# Altium schematic sheet PAGE1.SchDoc
size A3
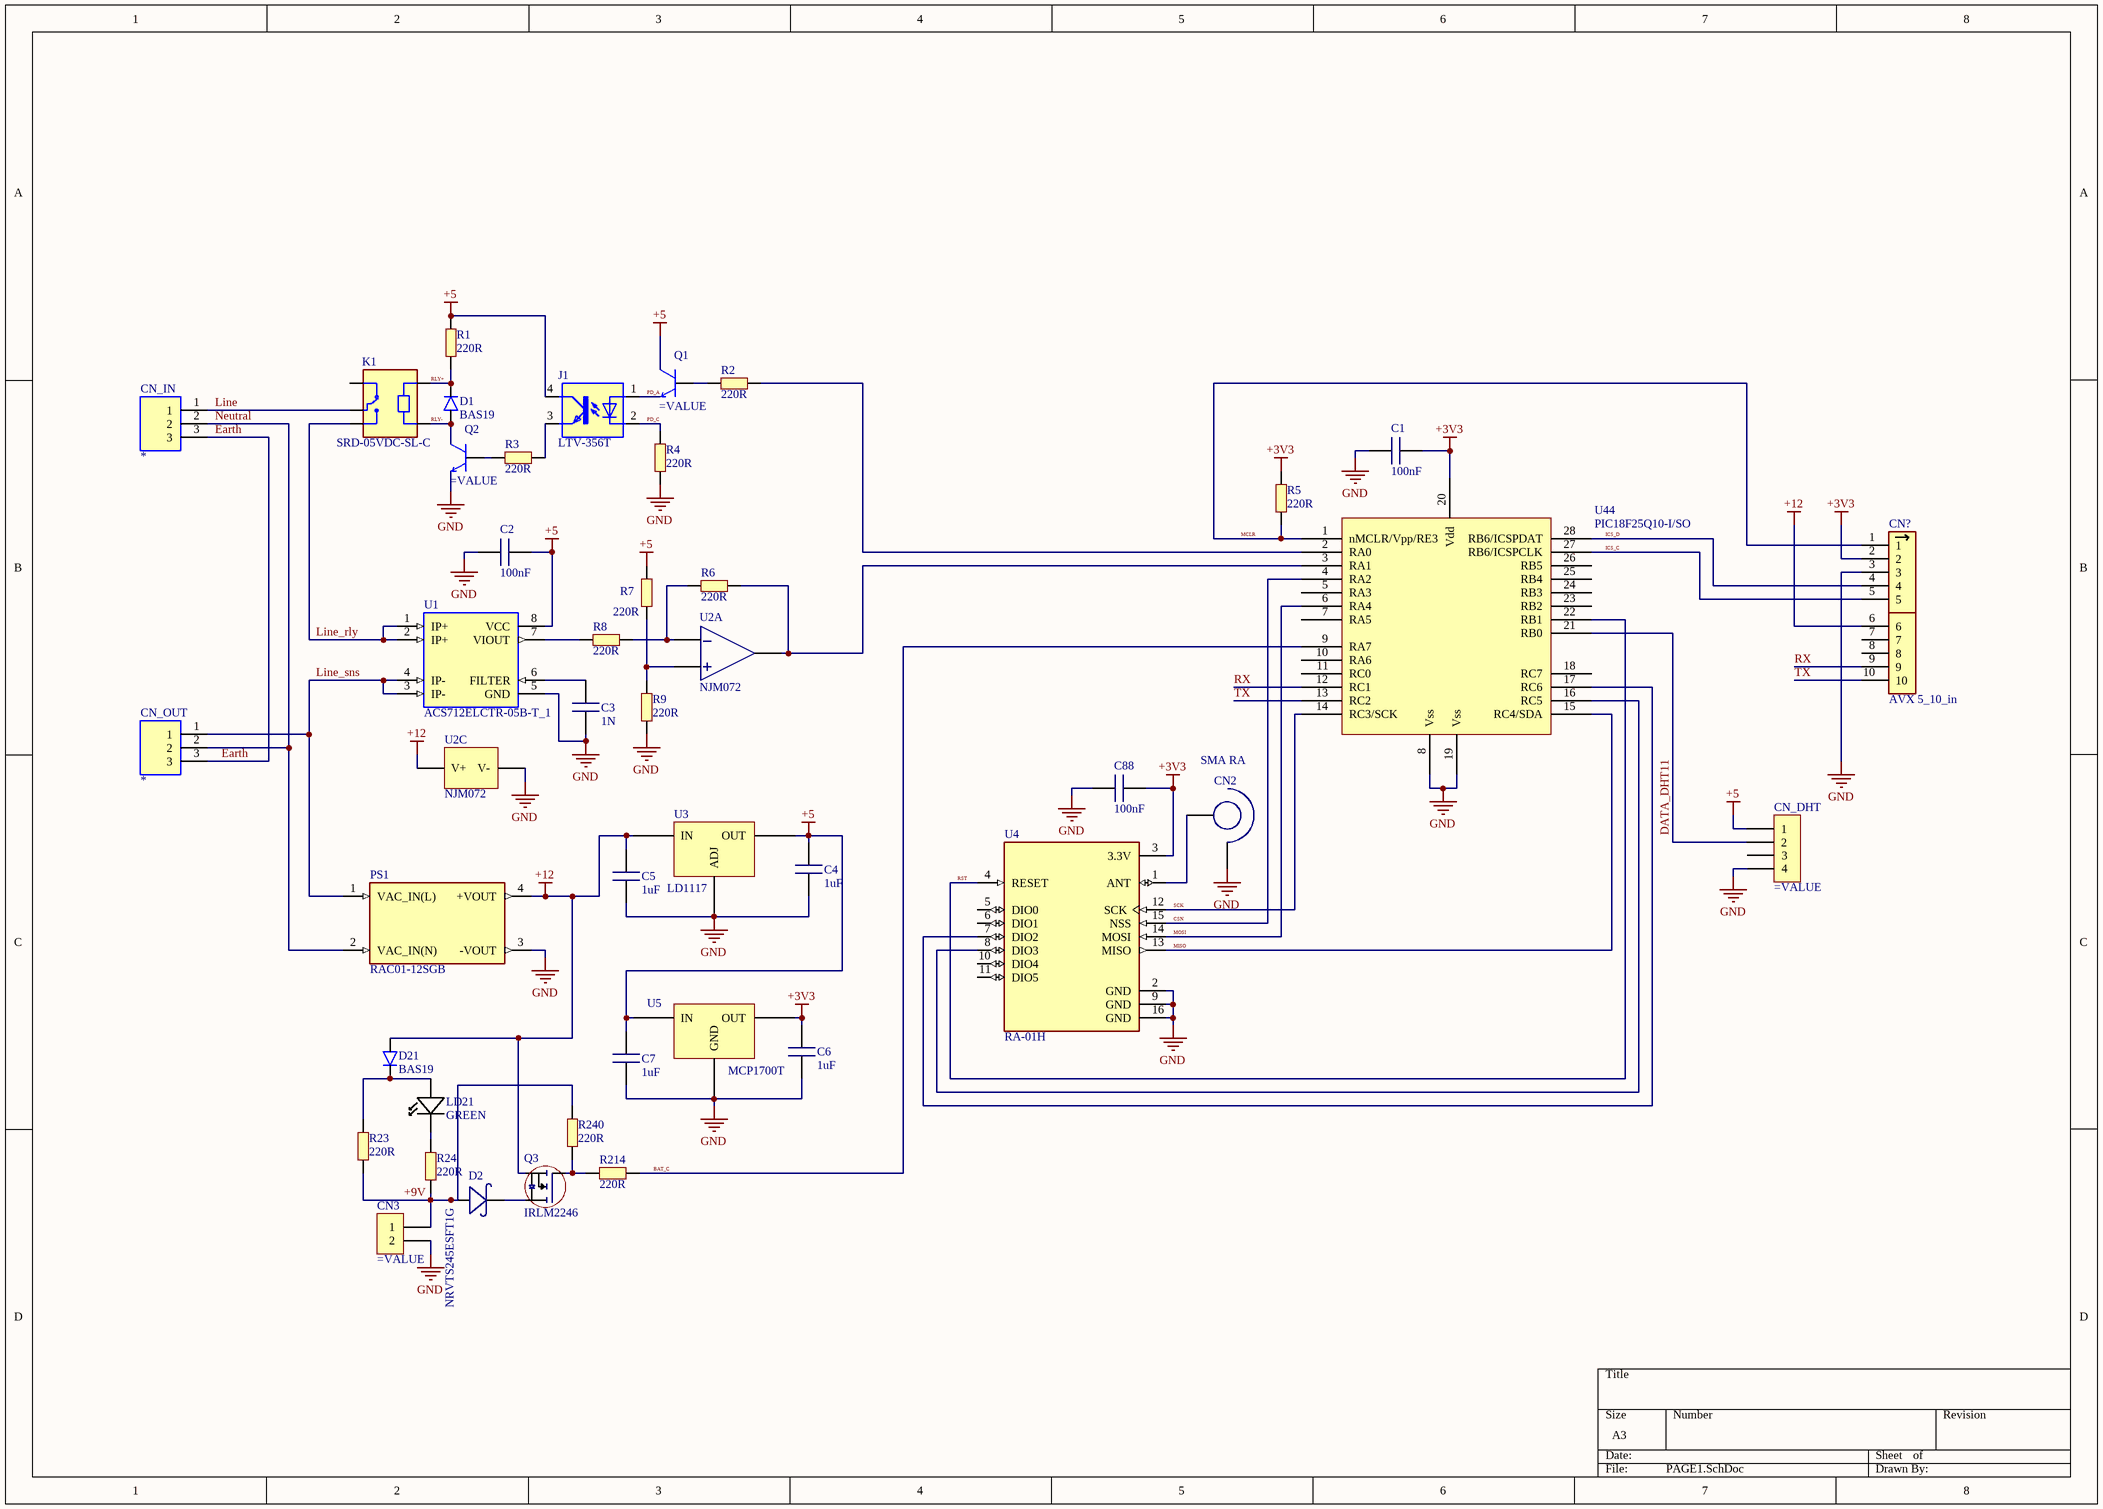
[diagram p0: PAGE1.SchDoc]

## Parts
C1  100nF  [CAP 0603]
C2  100nF  [CAP 0603]
C3  1N  [CAP 0603]
C4  1uF  [CAP 0603 1uF]
C5  1uF  [CAP 0603 1uF]
C6  1uF  [CAP 0603 1uF]
C7  1uF  [CAP 0603 1uF]
C88  100nF  [CAP 0603]
CN2  SMA RA  [LPRS SMA RA]
CN3  (no value)  [THT_Hdr_JST_XH_Fm_2x1_0.1_RA]
CN?  AVX 5_10_in  [AVX_10_in]
CN_DHT  (no value)  [THT_Hdr_JST_XH_Fm_4x1_0.1_RA]
CN_IN  282841-3  [TE_282841-3]  (value not drawn)
CN_OUT  282841-3  [TE_282841-3]  (value not drawn)
D1  BAS19  [SOT-23]
D2  NRVTS245ESFT1G  [SMA]
D21  BAS19  [SOT-23]
J1  LTV-356T  [MINI-FLAT-4]
K1  SRD-05VDC-SL-C  [RELAY_SRD-05VDC-SL-C]
LD21  GREEN  [LED 3X1.5]
PS1  RAC01-12SGB  [CONV_RAC01-12SGB]
Q1  (no value)  [[0301]BC846B_SOT23]
Q2  (no value)  [[0301]BC846B_SOT23]
Q3  IRLM2246  [SOT-23]
R1  220R  [RES 0603 220R]
R2  220R  [RES 0603 220R]
R3  220R  [RES 0603 220R]
R4  220R  [RES 0603 220R]
R5  220R  [RES 0603 220R]
R6  220R  [RES 0603 220R]
R7  220R  [RES 0603 220R]
R8  220R  [RES 0603 220R]
R9  220R  [RES 0603 220R]
R23  220R  [RES 0603 220R]
R24  220R  [RES 0603 220R]
R214  220R  [RES 0603 220R]
R240  220R  [RES 0603 220R]
U1  ACS712ELCTR-05B-T_1  [SOIC127P600X175-8N]
U2  NJM072  [SO-8]  (parts A,C of 3)
U3  LD1117  [SOT223]
U4  RA-01H  [XCVR_RA-01H]
U5  MCP1700T  [SOT-23]
U44  PIC18F25Q10-I/SO  [SOIC-28]

## Nets
+3V3: C1.1 C6.2 C88.1 CN?.2 R5.2 U4.3(3.3V) U5.2(OUT) U44.20(Vdd)
+5: C2.1 C4.2 C7.2 CN_DHT.1 J1.4(COL) Q1.3(C) R1.2 R7.2 U1.8(VCC) U3.2(OUT) U5.3(IN)
+12: C5.2 CN?.6 D21.1(A) PS1.4(+VOUT) Q3.2(S) U2.8(V+) U3.3(IN)
GND: C1.2 C2.2 C3.2 C4.1 C5.1 C6.1 C7.1 C88.2 CN2.2 CN3.2 CN?.3 CN_DHT.4 PS1.3(-VOUT) Q2.2(E) R4.2 R9.2 U1.5(GND) U2.4(V-) U3.1(ADJ) U4.2(GND) U4.9(GND) U4.16(GND) U5.1(GND) U44.8(Vss) U44.19(Vss)
+9V: CN3.1 D2.1(A) R23.2 R24.2 R240.1
BAT_C: R214.2 U44.9(RA7)
CSN: U4.15(NSS) U44.4(RA2)
DATA_DHT11: CN_DHT.2 U44.21(RB0)
Earth: CN_IN.3 CN_OUT.3
ICS_C: CN?.5 U44.27(RB6/ICSPCLK)
ICS_D: CN?.4 U44.28(RB6/ICSPDAT)
Line: CN_IN.1 K1.COM
Line_rly: K1.NO U1.1(IP+) U1.2(IP+)
Line_sns: CN_OUT.1 PS1.1(VAC_IN(L)) U1.3(IP-) U1.4(IP-)
MCLR: CN?.1 R5.1 U44.1(nMCLR/Vpp/RE3)
MISO: U4.13(MISO) U44.15(RC4/SDA)
MOSI: U4.14(MOSI) U44.6(RA4)
Neutral: CN_IN.2 CN_OUT.2 PS1.2(VAC_IN(N))
PD_A: J1.1(A) Q1.2(E)
PD_C: J1.2(C) R4.1
RLY+: D1.3(K) K1.A2 R1.1
RLY-: D1.1(A) K1.A1 Q2.3(C)
RST: U4.4(RESET) U44.22(RB1)
RX: CN?.9 U44.12(RC1)
SCK: U4.12(SCK) U44.14(RC3/SCK)
TX: CN?.10 U44.13(RC2)
NetC3_1: C3.1 U1.6(FILTER)
NetCN2_1: CN2.1 U4.1(ANT)
NetD2_2: D2.2(C) Q3.3(D)
NetD21_3: D21.3(K) LD21.1(AR) R23.1
NetJ1_3: J1.3(EMIT) R3.1
NetLD21_2: LD21.2(KR) R24.1
NetQ1_1: Q1.1(B) R2.1
NetQ2_1: Q2.1(B) R3.2
NetQ3_1: Q3.1(G) R214.1 R240.2
NetR2_2: R2.2 U44.2(RA0)
NetR6_1: R6.1 R8.2 U2.2(INV)
NetR6_2: R6.2 U2.1(OUTPUT) U44.3(RA1)
NetR7_1: R7.1 R9.1 U2.3(NONINV)
NetR8_1: R8.1 U1.7(VIOUT)
NetU4_7: U4.7(DIO2) U44.17(RC6)
NetU4_8: U4.8(DIO3) U44.16(RC5)

Not connected (* = marked no-connect by the designer): CN? 7 8; CN_DHT 3; K1 NC; U4 5(DIO0) 6(DIO1) 10(DIO4) 11(DIO5); U44 5(RA3) 7(RA5) 10(RA6) 11(RC0) 18(RC7) 23(RB2) 24(RB3) 25(RB4) 26(RB5)

## Library data of the parts
C1-C3 C88 = CAP 0603 100nF: Standard 100nF 25V 10% X7R 0603; MN: CC0603KRX7R9BB104; Value: 100nF; Footprint: 0603; Tolerance: 10%; Dielectric: X7R; Farnell: 2530141; LCSC: C14663
C4-C7 = CAP 0603 1uF: 16V 1uF X7R ±10% 0603 MLCC; MP: CS1608X7R105K160NRB; MN: Samwha Capacitor; Value: 1uF; Footprint: 0603; Tolerance: 10%; Dielectric: X7R; LCSC: C2918499
CN2 = SMA RA: RA SMA Connector; UA P/N: 209-6224; Value: SMA RA; Type: LPRS SMA RA CONNECTOR
CN3 = THT_Hdr_JST_XH_Fm_2x1_0.1_RA: JST XH Through-hole Header female 2x1 pitch 0.1'' Right angle
CN? = AVX 5_10_in: MP: 009159010061916; MF: AVX; Package: None; Price: None; Value: *; Availability: Unavailable; Mouser: 581-009159010061916; Digikey: 478-8659-ND
CN_DHT = THT_Hdr_JST_XH_Fm_4x1_0.1_RA: JST XH Through-hole Header female 4x1 pitch 0.1'' Right angle
CN_IN CN_OUT = 282841-3: Conn Terminal Block 3 POS 5.08mm Solder ST Thru-Hole 17.5A/Contact; MF: TE Connectivity; Package: None; Price: None; Check_prices: https://www.snapeda.com/parts/282841-3/TE+Connectivity+AMP+Connectors/view-part/?ref=eda; Value: *; SnapEDA_Link: https://www.snapeda.com/parts/282841-3/TE+Connectivity+AMP+Connectors/view-part/?ref=snap; MP: 282841-3; EU_RoHS_Compliance: Compliant with Exemptions; Availability: In Stock; Purchase-URL: https://pricing.snapeda.com/search?q=282841-3&ref=eda; LCSC: C474886; Comment_1: *
D1 D21 = BAS19: Diode Standard 250V 200mA Surface Mount SOT-23-3 _TO-236_; MF: onsemi; MP: BAS19LT1G; Value: BAS19; SnapEDA_Link: https://www.snapeda.com/parts/BAS21/ON%20Semiconductor/view-part/2747894/?ref=snap; Price: US$0.0277; Availability: Unavailable; Package: SOT-23-3 Rectron; LCSC: C232582
D2 = NRVTS245ESFT1G: Schottky Rectifier, 45 V, 2 A, Single, SOD-123, 2 Pins, 650 mV; Type: SMD DIODE SHOTTKY 45V 2A; UA P/N: 15-0042; Value: NRVTS245ESFT1G
J1 = LTV-356T: Optoisolator Transistor Output 3750Vrms 1 Channel 4-SOP; MF: Lite-On Inc.; Package: SOP-4 Lite-On Inc.; Value: *; Check_prices: https://www.snapeda.com/parts/LTV-356T/Lite-On+Inc./view-part/?ref=eda; SnapEDA_Link: https://www.snapeda.com/parts/LTV-356T/Lite-On+Inc./view-part/?ref=snap; Availability: In Stock; Purchase-URL: https://pricing.snapeda.com/search/part/LTV-356T/?ref=eda; MP: LTV-356T; Price: None; LCSC: C125117
K1 = SRD-05VDC-SL-C: 5V Trigger Relay Module For Arduino And Raspberry Pi 5V Trigger Relay Module For Arduino And Raspberry Pi; MF: Songle Relay; Check_prices: https://www.snapeda.com/parts/SRD-05VDC-SL-C/Songle+Relay/view-part/?ref=eda; Value: *; Availability: Not in stock; Price: None; Package: NON STANDARD-5 Songle Relay; MP: SRD-05VDC-SL-C; SnapEDA_Link: https://www.snapeda.com/parts/SRD-05VDC-SL-C/Songle+Relay/view-part/?ref=snap; LCSC: C140615
LD21 = LED GREEN: Standard LED 1206; Type: KINGBRIGHT; UA P/N: 15-0020; Value: GREEN
PS1 = RAC01-12SGB: AC/DC Converter, 1 Watt, Single Output, EMC Class B; Package: None; Price: None; Value: *; MP: RAC01-12SGB; Availability: Unavailable; LCSC: TDPOWER TAS3-12-WEDT
Q1 Q2 = NPN SOT-23: NPN SOT-23 transistor [0301]BC846B_SOT23
Q3 = IRLML2246: N Channel MOSFET, SOT-23, Simulation; UA P/N: 15-0064; Value: IRLM2246
R1-R9 R23 R24 R214 R240 = RES0603_220R: 1/10W ±1% 220Ω ±100ppm/℃ 0603; UA P/N: 13-0004; MP: CR0603F220RP05Z; MN: Ever Ohms Tech; Value: 220R; Footprint: 0603; Type: THICK FILM; LCSC: C881327; Price: US$0.0018
U1 = ACS712ELCTR-05B-T_1: Current Sensor 5A 1 Channel Hall Effect, Open Loop Bidirectional 8-SOIC (0.154, 3.90mm Width); MF: Allegro; SnapEDA_Link: https://www.snapeda.com/parts/ACS712ELCTR-05B-T/Allegro%20Industries/view-part/330078/?ref=snap; Availability: In Stock; Check_prices: https://www.snapeda.com/parts/ACS712ELCTR-05B-T/Allegro%20Industries/view-part/330078/?ref=eda; Value: *; Package: SOIC-8 Allegro MicroSystems LLC; MP: ACS712ELCTR-05B-T; Price: None; LCSC: C44471
U2 = NJM072: Dual OPAMP SOIC Package; Value: NJM072
U3 = LD1117-3.3: LD1117STR Adjustable 1.25V-15V LDO, 800mA; UA P/N: 146-7776; Value: LD1117-3.3; Type: LDO
U4 = RA-01H: MÃ´-Ä‘un thu phÃ¡t LoRaâ„¢ ISM < 1GHz chung KhÃ´ng bao gá»“m Äƒng-ten 803 MHz ~ 930 MHz GiÃ¡ treo bá» máº·t; MF: AI-Thinker; SnapEDA_Link: https://www.snapeda.com/parts/RA-01H/AI-Thinker/view-part/?ref=snap; Package: Package; Value: *; MP: RA-01H; Check_prices: https://www.snapeda.com/parts/RA-01H/AI-Thinker/view-part/?ref=eda; LCSC: C503593
U5 = MCP1700T: UA P/N: 1296592; Value: MCP1700T; Type: 3V3 LDO REGULATOR
U44 = PIC18F25Q10-I/SO: PIC 18F25Q10-I/SO, SOIC 28 pins, MCU8, 16Kb flash, 1Kb RAM, 256B EEPROM; LatestRevisionDate: 17-Sep-2020; LatestRevisionNote: Created by Adrian; UA P/N: *; Value: PIC18F25Q10-I/SO; Farnell: 3380497